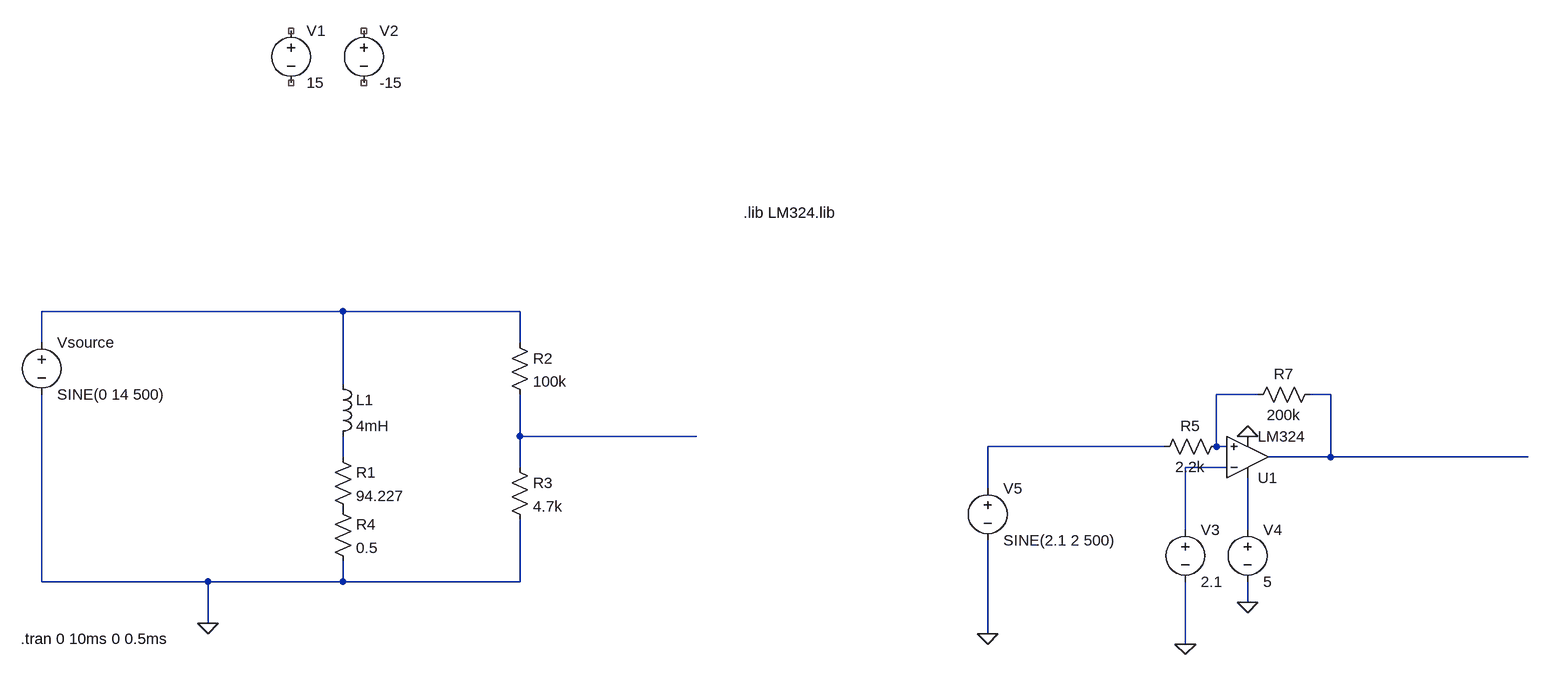
[diagram p0: schematic roughTester.asc]
roughTester.asc, the LTspice schematic file:
Version 4.1
SHEET 1 2132 804
WIRE 304 272 -160 272
WIRE 576 272 304 272
WIRE -160 320 -160 272
WIRE 576 320 576 272
WIRE 304 384 304 272
WIRE 1712 400 1648 400
WIRE 1824 400 1792 400
WIRE 576 464 576 400
WIRE 848 464 576 464
WIRE 1568 480 1296 480
WIRE 1648 480 1648 400
WIRE 1664 480 1648 480
WIRE 304 496 304 464
WIRE 1824 496 1824 400
WIRE 1824 496 1728 496
WIRE 2128 496 1824 496
WIRE 576 512 576 464
WIRE 1664 512 1600 512
WIRE 1296 544 1296 480
WIRE 1600 608 1600 512
WIRE 1696 608 1696 528
WIRE -160 688 -160 400
WIRE 96 688 -160 688
WIRE 304 688 304 656
WIRE 304 688 96 688
WIRE 576 688 576 592
WIRE 576 688 304 688
WIRE 1696 720 1696 688
WIRE 96 752 96 688
WIRE 1296 768 1296 624
WIRE 1600 784 1600 688
FLAG 96 752 0
FLAG 1600 784 0
FLAG 1696 464 0
FLAG 1696 720 0
FLAG 1296 768 0
SYMBOL voltage -160 304 R0
WINDOW 123 0 0 Left 0
WINDOW 39 0 0 Left 0
SYMATTR InstName Vsource
SYMATTR Value SINE(0 14 500)
SYMBOL ind 288 368 R0
SYMATTR InstName L1
SYMATTR Value 4mH
SYMATTR SpiceLine Rser=1m
SYMBOL res 288 480 R0
SYMATTR InstName R1
SYMATTR Value 94.227
SYMBOL res 560 304 R0
SYMATTR InstName R2
SYMATTR Value 100k
SYMBOL res 560 496 R0
SYMATTR InstName R3
SYMATTR Value 4.7k
SYMBOL res 288 560 R0
SYMATTR InstName R4
SYMATTR Value 0.5
SYMBOL OpAmps\\opamp2 1696 560 M180
SYMATTR InstName U1
SYMATTR Value LM324
SYMBOL voltage 224 -176 R0
WINDOW 123 0 0 Left 0
WINDOW 39 0 0 Left 0
SYMATTR InstName V1
SYMATTR Value 15
SYMBOL voltage 336 -176 R0
WINDOW 123 0 0 Left 0
WINDOW 39 0 0 Left 0
SYMATTR InstName V2
SYMATTR Value -15
SYMBOL res 1664 464 R90
WINDOW 0 0 56 VBottom 2
WINDOW 3 32 56 VTop 2
SYMATTR InstName R5
SYMATTR Value 2.2k
SYMBOL res 1808 384 R90
WINDOW 0 0 56 VBottom 2
WINDOW 3 32 56 VTop 2
SYMATTR InstName R7
SYMATTR Value 200k
SYMBOL voltage 1600 592 R0
WINDOW 123 0 0 Left 0
WINDOW 39 0 0 Left 0
SYMATTR InstName V3
SYMATTR Value 2.1
SYMBOL voltage 1696 592 R0
WINDOW 123 0 0 Left 0
WINDOW 39 0 0 Left 0
SYMATTR InstName V4
SYMATTR Value 5
SYMBOL voltage 1296 528 R0
WINDOW 123 0 0 Left 0
WINDOW 39 0 0 Left 0
SYMATTR InstName V5
SYMATTR Value SINE(2.1 2 500)
TEXT -192 776 Left 2 !.tran 0 10ms 0 0.5ms
TEXT 920 120 Left 2 !.lib LM324.lib

The netlist it stands for:
* roughTester.asc
Vsource N001 0 SINE(0 14 500)
L1 N001 N006 4mH Rser=1m
R1 N006 P001 94.227
R2 N001 N004 100k
R3 N004 0 4.7k
R4 P001 0 0.5
X§U1 N002 N007 N008 0 N003 LM324  ; pins In+ In- V+ V- OUT
V1 NC_01 NC_02 15
V2 NC_03 NC_04 -15
R5 N002 N005 2.2k
R7 N003 N002 200k
V3 N007 0 2.1
V4 N008 0 5
V5 N005 0 SINE(2.1 2 500)
.tran 0 10ms 0 0.5ms
.lib LM324.lib
.backanno
.end